# Altium schematic sheet 3-RT5572-WLAN.SchDoc
size A2
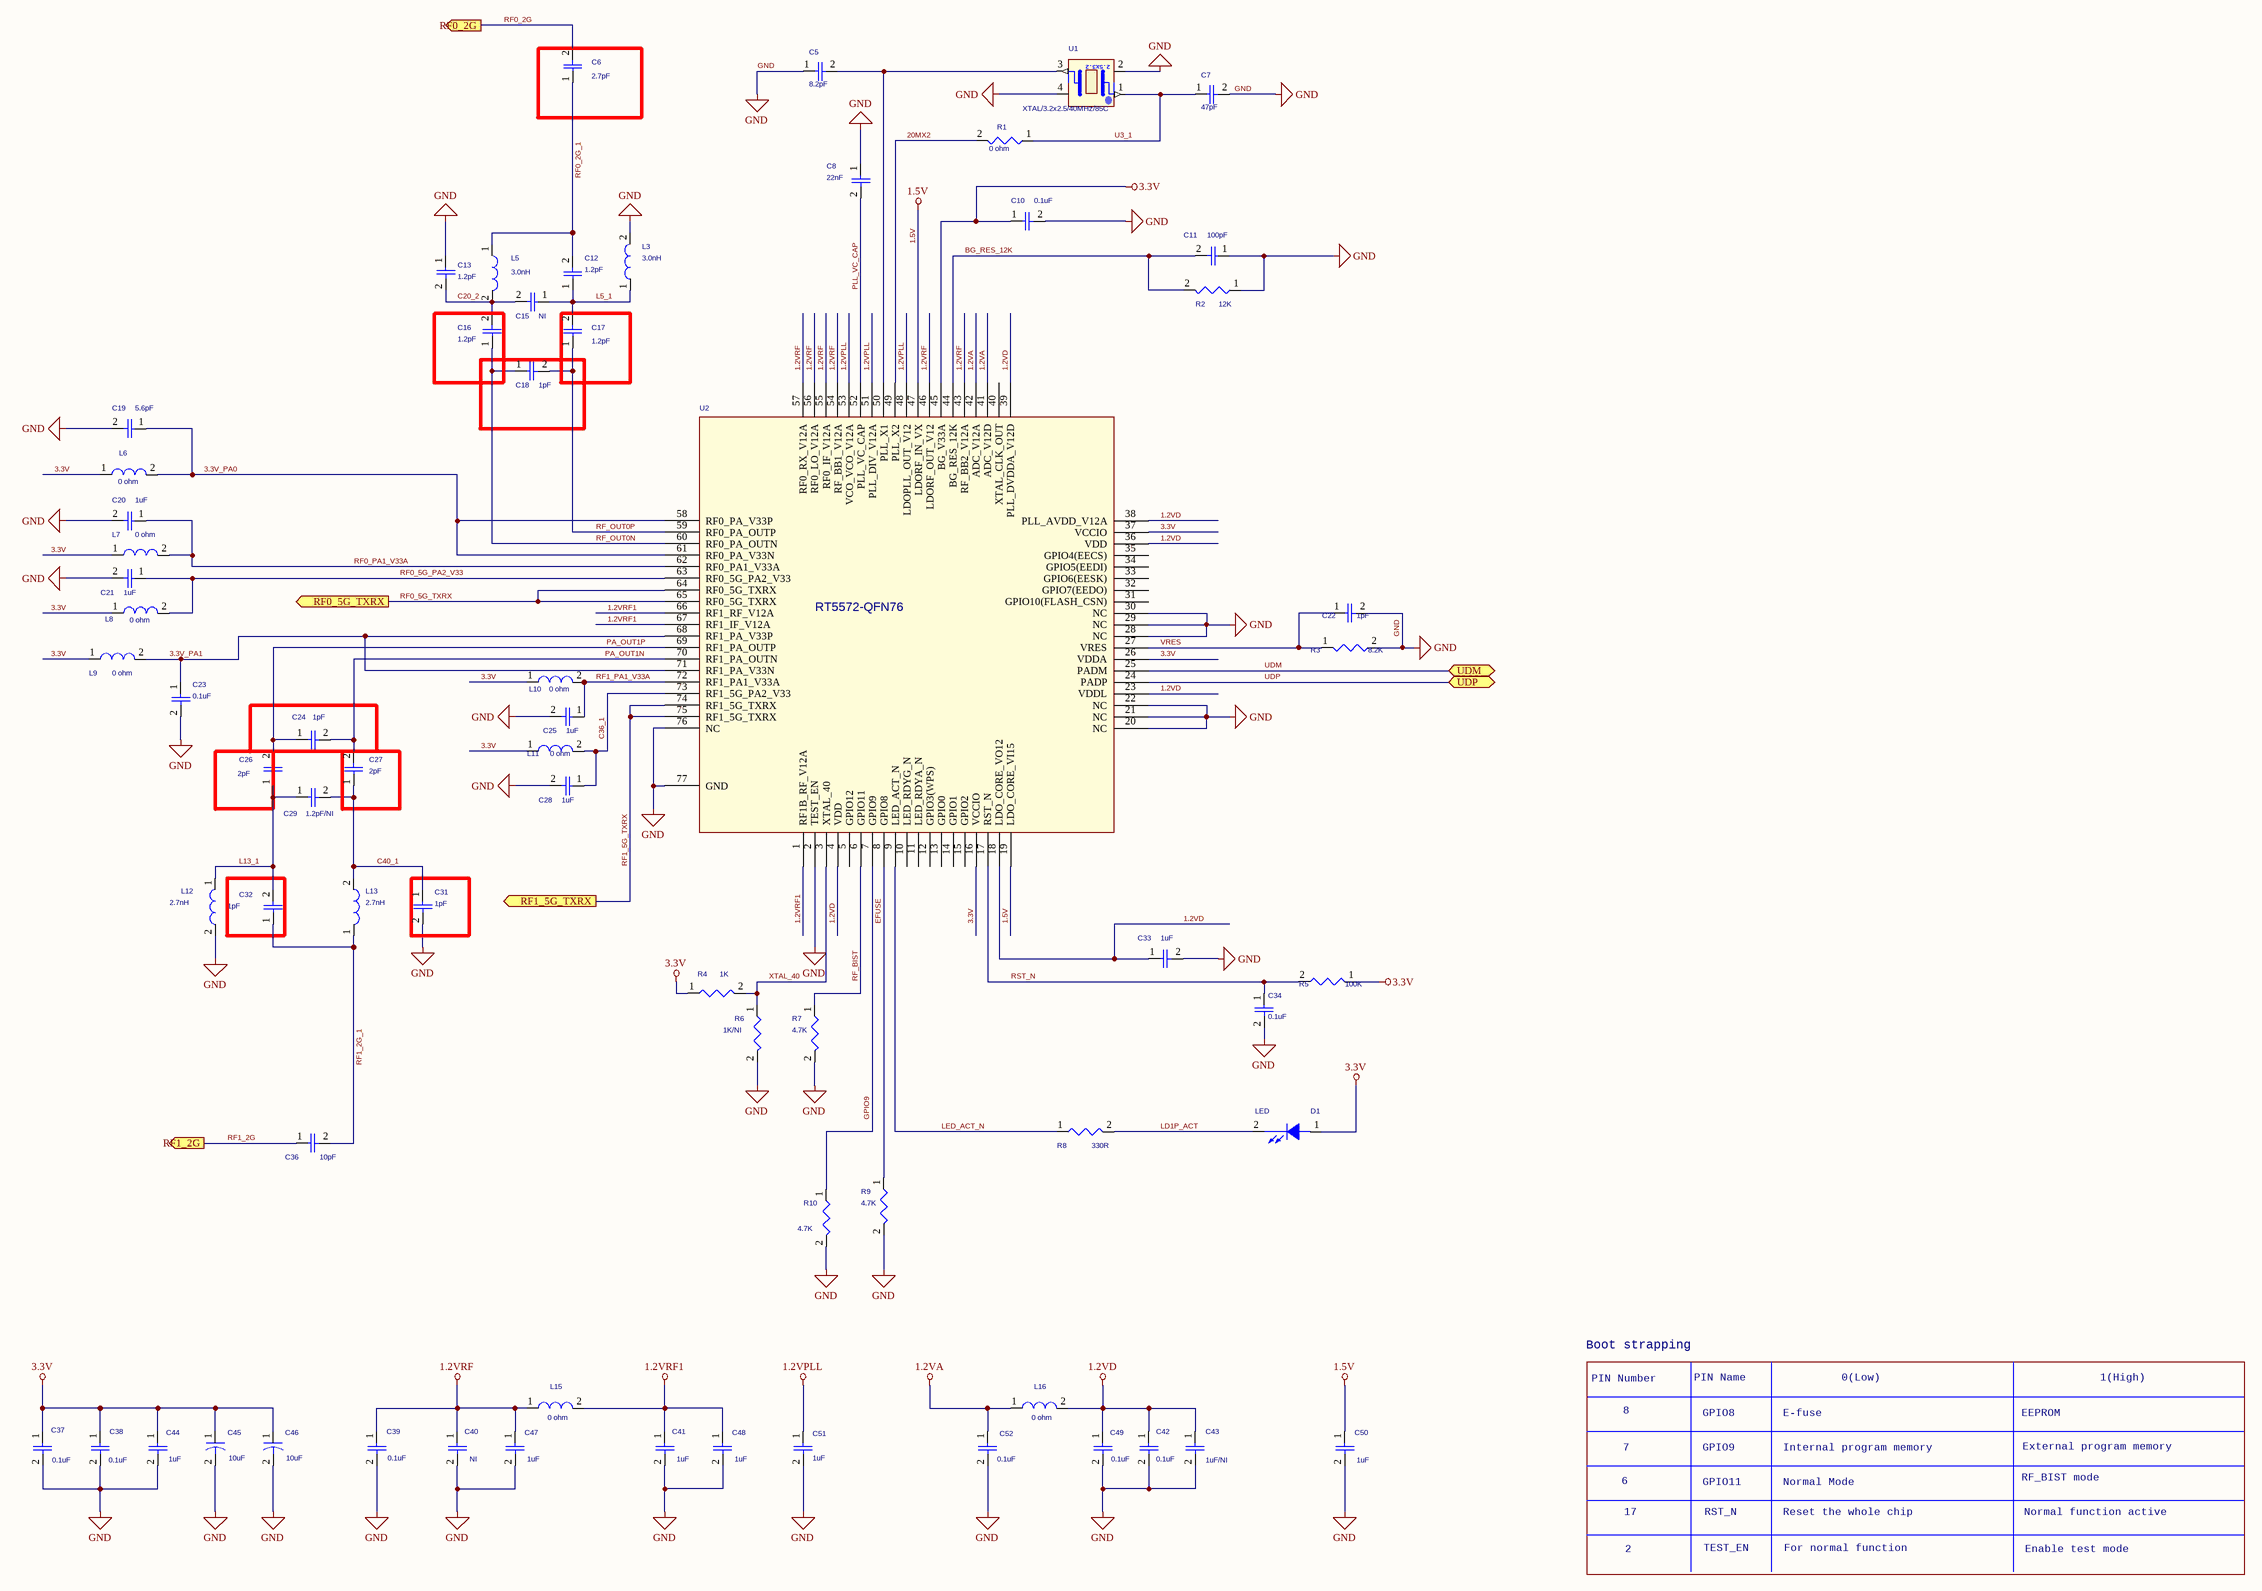
[diagram p0: 3-RT5572-WLAN.SchDoc]

## Parts
C5  8.2pF  [0402]
C6  2.7pF  [0402]
C7  47pF  [0402]
C8  22nF  [0402]
C10  0.1uF  [0402]
C11  100pF  [0402]
C12  1.2pF  [0402]
C13  1.2pF  [0402]
C15  NI  [0402]
C16  1.2pF  [0402]
C17  1.2pF  [0402]
C18  1pF  [0402]
C19  5.6pF  [0402]
C20  1uF  [0402]
C21  1uF  [0402]
C22  1pF  [0402]
C23  0.1uF  [0402]
C24  1pF  [0402]
C25  1uF  [0402]
C26  2pF  [0402]
C27  2pF  [0402]
C28  1uF  [0402]
C29  1.2pF/NI  [0402]
C31  1pF  [0402]
C32  1pF  [0402]
C33  1uF  [0402]
C34  0.1uF  [0402]
C36  10pF  [0402]
C37  0.1uF  [0402]
C38  0.1uF  [0402]
C39  0.1uF  [0402]
C40  NI  [0402]
C41  1uF  [0402]
C42  0.1uF  [0402]
C43  1uF/NI  [0402]
C44  1uF  [0402]
C45  10uF  [0805]
C46  10uF  [0805]
C47  1uF  [0402]
C48  1uF  [0402]
C49  0.1uF  [0402]
C50  1uF  [0402]
C51  1uF  [0402]
C52  0.1uF  [0402]
D1  LED  [0603]
L3  3.0nH  [0402]
L5  3.0nH  [0402]
L6  0 ohm  [0402]
L7  0 ohm  [0402]
L8  0 ohm  [0402]
L9  0 ohm  [0402]
L10  0 ohm  [0402]
L11  0 ohm  [0402]
L12  2.7nH  [0402]
L13  2.7nH  [0402]
L15  0 ohm  [0402]
L16  0 ohm  [0402]
R1  0 ohm  [0402]
R2  12K  [0402]
R3  8.2K  [0402]
R4  1K  [0402]
R5  100K  [0402]
R6  1K/NI  [0402]
R7  4.7K  [0402]
R8  330R  [0402]
R9  4.7K  [0402]
R10  4.7K  [0402]
U1  XTAL/3.2x2.5/40MHz/85C  [XTAL-SMD/3.2X2.5]
U2  RT5572-QFN76  [QFN40P-900X900X90-77N]

## Ports
RF0_2G (out), RF0_5G_TXRX (out), RF1_2G (out), RF1_5G_TXRX (out), UDM (bidir), UDP (bidir)

## Nets
1.2VA: C52.1 L16.1 U2.41(ADC_V12D) U2.42(ADC_V12A)
1.2VD: C33.1 C42.1 C43.1 C49.1 L16.2 U2.4(VDD) U2.18(LDO_CORE_VO12) U2.23(VDDL) U2.36(VDD) U2.38(PLL_AVDD_V12A) U2.39(PLL_DVDDA_V12D)
1.2VPLL: C51.1 U2.48(LDOPLL_OUT_V12) U2.51(PLL_DIV_V12A) U2.53(VCO_VCO_V12A)
1.2VRF: C39.1 C40.1 C47.1 L15.1 U2.43(RF_BB2_V12A) U2.46(LDORF_OUT_V12) U2.54(RF_BB1_V12A) U2.55(RF0_IF_V12A) U2.56(RF0_LO_V12A) U2.57(RF0_RX_V12A)
1.2VRF1: C41.1 C48.1 L15.2 U2.1(RF1B_RF_V12A) U2.66(RF1_RF_V12A) U2.67(RF1_IF_V12A)
1.5V: C50.1 U2.19(LDO_CORE_VI15) U2.47(LDORF_IN_VX)
3.3V: C10.1 C37.1 C38.1 C44.1 C45.1 C46.1 D1.1(ANODE) L6.1 L7.1 L8.1 L9.1 L10.1 L11.1 R4.1 R5.1 U2.16(VCCIO) U2.26(VDDA) U2.37(VCCIO) U2.45(BG_V33A)
GND: C5.1 C7.2 C8.1 C10.2 C11.1 C13.1 C19.2 C20.2 C21.2 C22.2 C23.2 C25.2 C28.2 C31.2 C33.2 C34.2 C37.2 C38.2 C39.2 C40.2 C41.2 C42.2 C43.2 C44.2 C45.2 C46.2 C47.2 C48.2 C49.2 C50.2 C51.2 C52.2 L3.2 L12.2 R2.1 R3.2 R6.2 R7.2 R9.2 R10.2 U1.2(NC) U1.4(NC) U2.2(TEST_EN) U2.20(NC) U2.21(NC) U2.22(NC) U2.28(NC) U2.29(NC) U2.30(NC) U2.76(NC) U2.77(GND)
3.3V_PA0: C19.1 L6.2 U2.58(RF0_PA_V33P) U2.61(RF0_PA_V33N)
3.3V_PA1: C23.1 L9.2 U2.68(RF1_PA_V33P) U2.71(RF1_PA_V33N)
20MX2: R1.2 U2.49(PLL_X2)
BG_RES_12K: C11.2 R2.2 U2.44(BG_RES_12K)
C20_2: C13.2 C15.2 C16.2 L5.2
C36_1: C28.1 L11.2 U2.73(RF1_5G_PA2_V33)
C40_1: C27.1 C29.2 C31.1 L13.2
EFUSE: R9.1 U2.8(GPIO8)
GPIO9: R10.1 U2.7(GPIO9)
L5_1: C12.1 C15.1 C17.2 L3.1
L13_1: C26.1 C29.1 C32.2 L12.1
LD1P_ACT: D1.2(CATHODE) R8.2
LED_ACT_N: R8.1 U2.9(LED_ACT_N)
PA_OUT1N: C24.2 C27.2 U2.70(RF1_PA_OUTN)
PA_OUT1P: C24.1 C26.2 U2.69(RF1_PA_OUTP)
PLL_VC_CAP: C8.2 U2.52(PLL_VC_CAP)
RF0_2G: C6.2 ; port RF0_2G
RF0_2G_1: C6.1 C12.2 L5.1
RF0_5G_PA2_V33: C21.1 L8.2 U2.63(RF0_5G_PA2_V33)
RF0_5G_TXRX: U2.64(RF0_5G_TXRX) U2.65(RF0_5G_TXRX) ; port RF0_5G_TXRX
RF0_PA1_V33A: C20.1 L7.2 U2.62(RF0_PA1_V33A)
RF1_2G: C36.1 ; port RF1_2G
RF1_2G_1: C32.1 C36.2 L13.1
RF1_5G_TXRX: U2.74(RF1_5G_TXRX) U2.75(RF1_5G_TXRX) ; port RF1_5G_TXRX
RF1_PA1_V33A: C25.1 L10.2 U2.72(RF1_PA1_V33A)
RF_BIST: R7.1 U2.6(GPIO11)
RF_OUT0N: C16.1 C18.1 U2.60(RF0_PA_OUTN)
RF_OUT0P: C17.1 C18.2 U2.59(RF0_PA_OUTP)
RST_N: C34.1 R5.2 U2.17(RST_N)
U3_1: C7.1 R1.1 U1.1(X1)
UDM: U2.25(PADM) ; port UDM
UDP: U2.24(PADP) ; port UDP
VRES: C22.1 R3.1 U2.27(VRES)
XTAL_40: R4.2 R6.1 U2.3(XTAL_40)
NetC5_2: C5.2 U1.3(X2) U2.50(PLL_X1)

Not connected (* = marked no-connect by the designer): U2 5(GPIO12) 10(LED_RDYG_N) 11(LED_RDYA_N) 12(GPIO3(WPS)) 13(GPIO0) 14(GPIO1) 15(GPIO2) 31(GPIO10(FLASH_CSN)) 32(GPIO7(EEDO)) 33(GPIO6(EESK)) 34(GPIO5(EEDI)) 35(GPIO4(EECS)) 40(XTAL_CLK_OUT)

## Notes on the sheet
- Boot strapping
- PIN Number
- PIN Name
- 0(Low)
- 1(High)
- 8
- 7
- GPIO8
- GPIO9
- E-fuse
- Internal program memory
- EEPROM
- External program memory
- 6
- GPIO11
- Normal Mode
- RF_BIST mode
- 17
- 2
- TEST_EN
- RST_N
- Reset the whole chip
- For normal function
- Normal function active
- Enable test mode
- (in symbol XTAL_2.5) 2.5x3.2

## Library data of the parts
C5-C8 C10-C13 C15-C29 C31-C34 C36-C44 C47-C52 = CAP/0402
  C8 C10 C11 C19-C23 C25 C28 C33 C34 C37-C44 C47-C52: 1st Part Field: 0402
C45 C46 = CAP/0603
D1 = LED/0603
L3 L5-L11 L13 L15 L16 = L/0402
L12 = L/0402_0
R1 R2 R5 = RES/0402_1_Dup1
R3 = RES/0402_2
R4 R6 R7 R9 R10 = RES/0402_1_Dup2
R8 = RES/0402_1
U1 = XTAL_2.5
U2 = RT5572_5